# Altium schematic sheet 05 MCU_C.SchDoc
size 513 x 386 mm
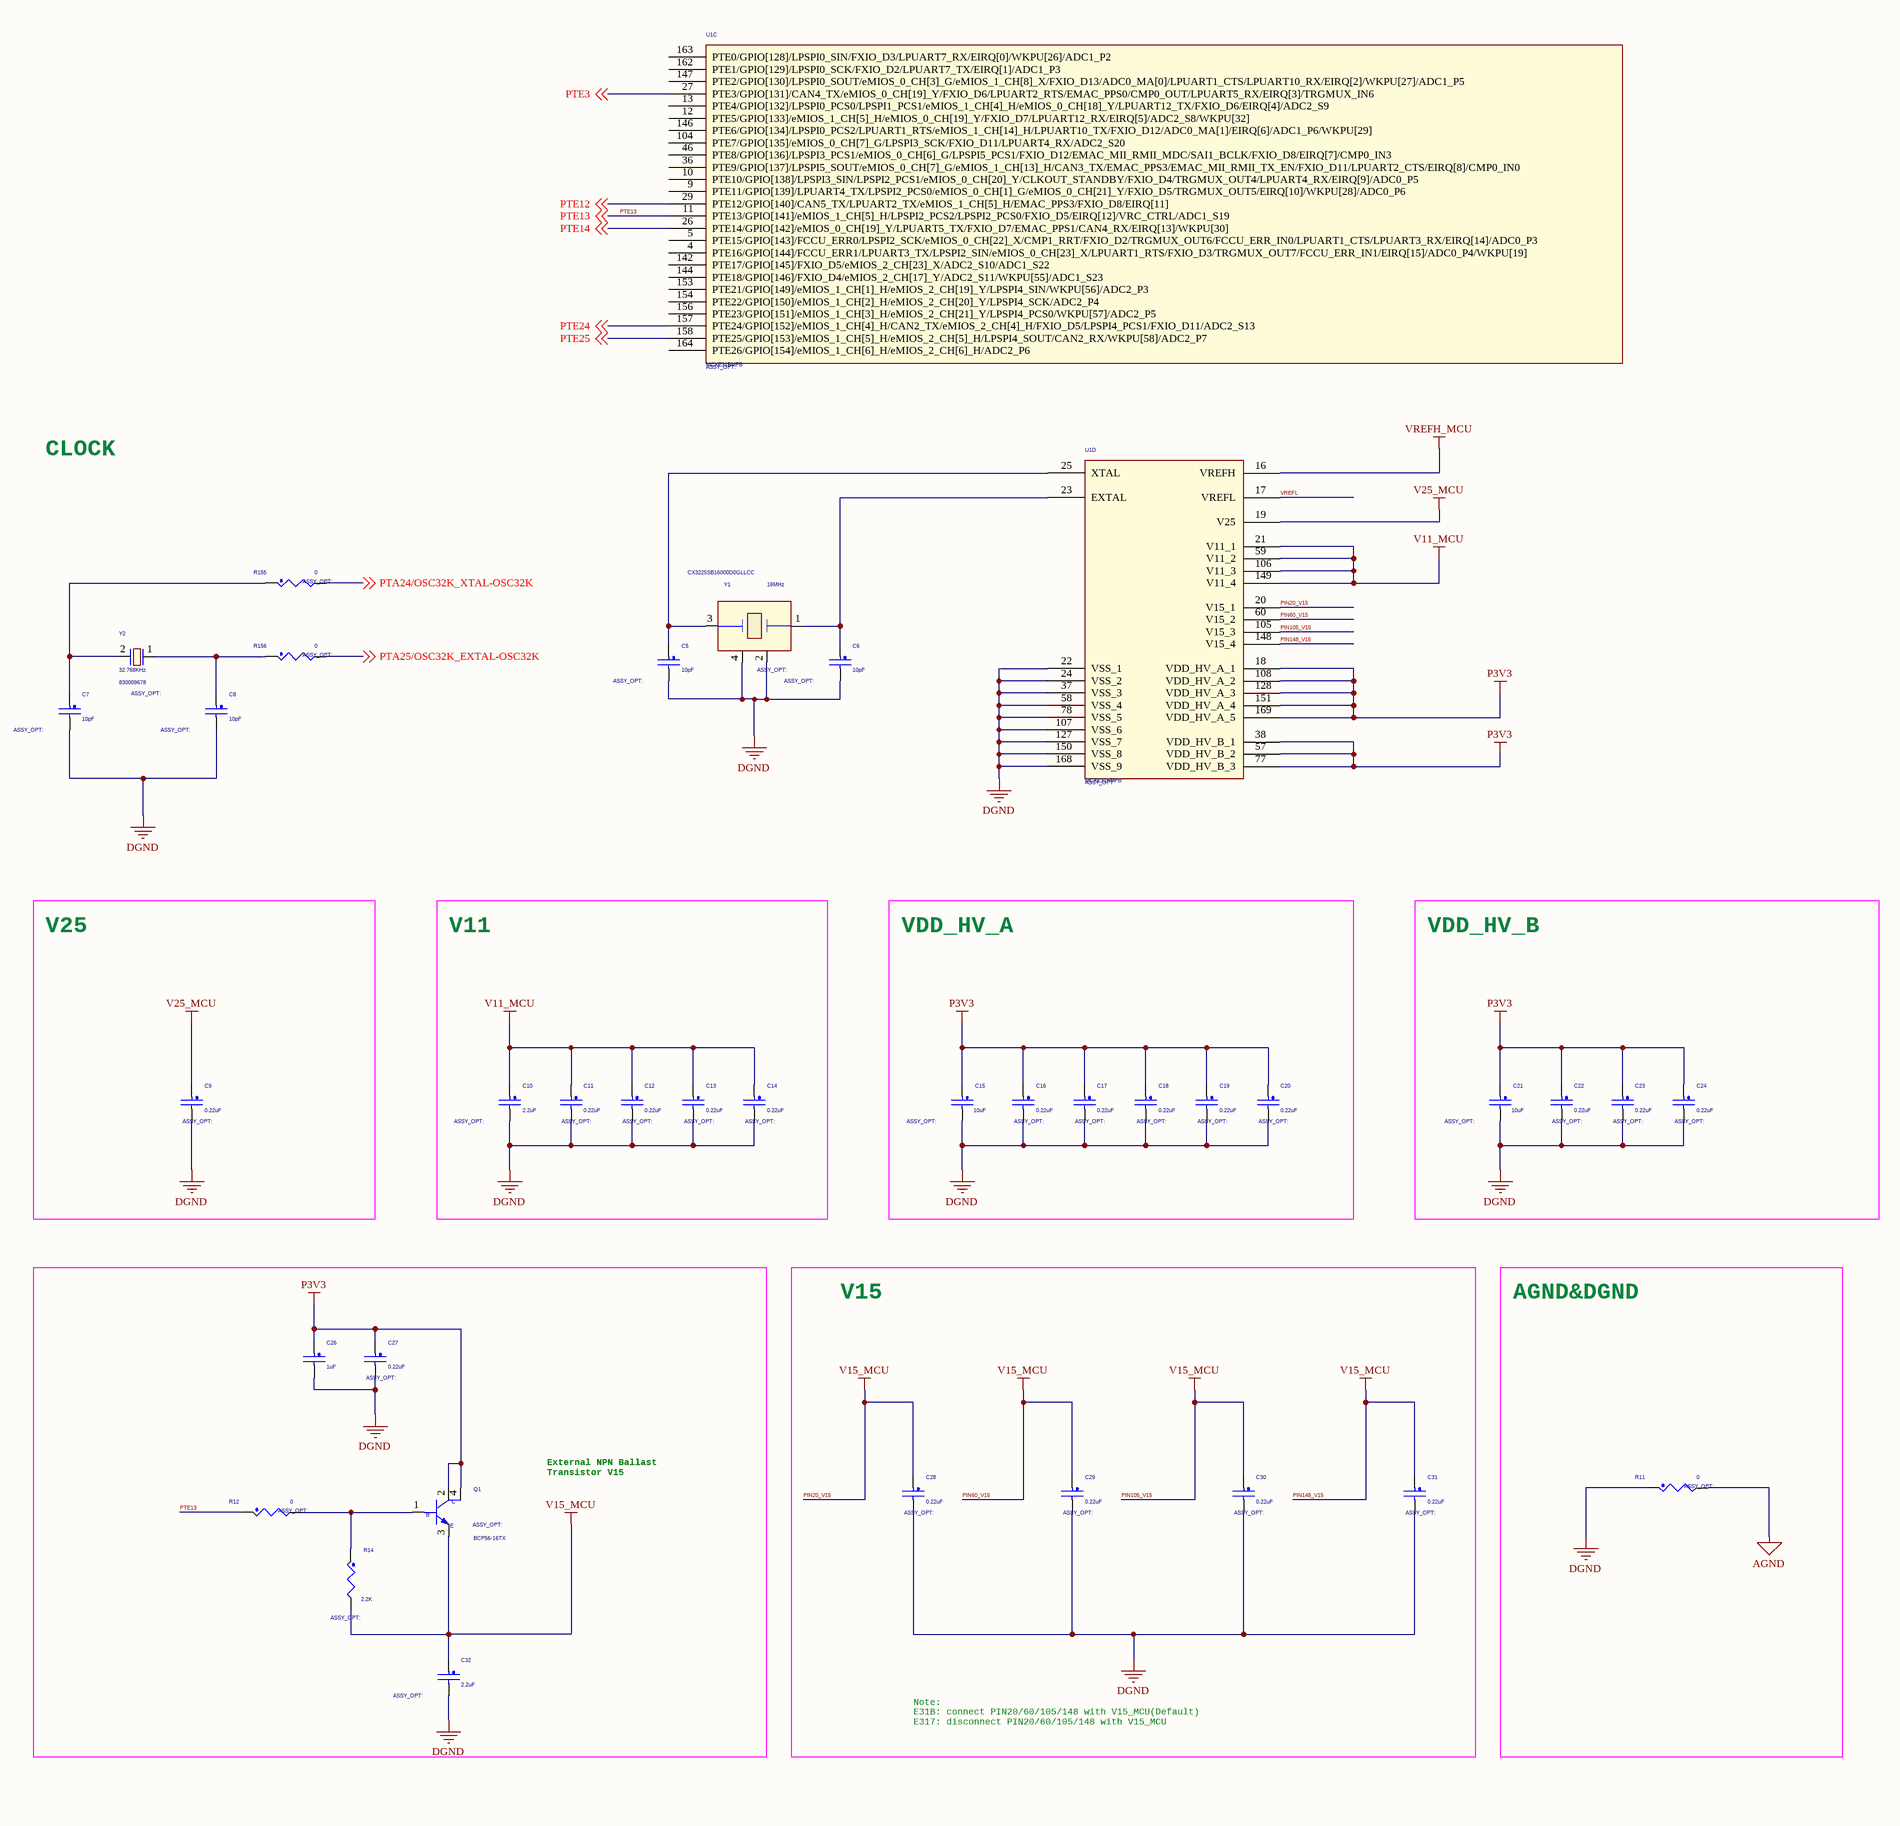
[diagram p0: 05 MCU_C.SchDoc, left]
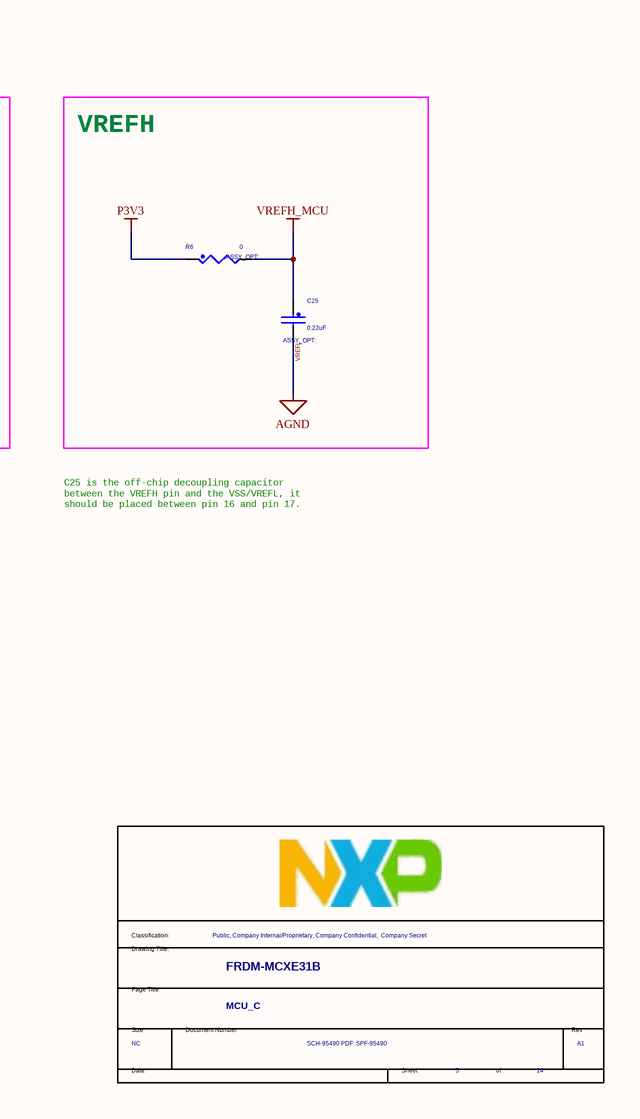
[diagram p1: 05 MCU_C.SchDoc, right]

## Parts
*  Title: FRDM-MCXE31B  RevCode: A1  PageTitle: MCU_C  Page Size: NC  Page Number: 5  Page Count: 14  Doc: SCH-95490 PDF: SPF-95490  Classification: Public, Company Internal/Proprietary, Company Confidential,  Company Secret  (hidden comment: TitleBlock_FS)  (graphical)
C5  10pF  [CC0402_25]
C6  10pF  [CC0402_25]
C7  10pF  [CC0402_25]
C8  10pF  [CC0402_25]
C9  0.22uF  [CC0402_25]
C10  2.2uF  [CC0402_25]
C11  0.22uF  [CC0402_25]
C12  0.22uF  [CC0402_25]
C13  0.22uF  [CC0402_25]
C14  0.22uF  [CC0402_25]
C15  10uF  [CC0603_OV]
C16  0.22uF  [CC0402_25]
C17  0.22uF  [CC0402_25]
C18  0.22uF  [CC0402_25]
C19  0.22uF  [CC0402_25]
C20  0.22uF  [CC0402_25]
C21  10uF  [CC0603_OV]
C22  0.22uF  [CC0402_25]
C23  0.22uF  [CC0402_25]
C24  0.22uF  [CC0402_25]
C25  0.22uF  [CC0402_25]
C26  1uF  [CC0402_25]
C27  0.22uF  [CC0402_25]
C28  0.22uF  [CC0402_25]
C29  0.22uF  [CC0402_25]
C30  0.22uF  [CC0402_25]
C31  0.22uF  [CC0402_25]
C32  2.2uF  [CC0402_25]
Q1  BCP56-16TX  [SOT223]
R6  0  [RC0402_25]
R11  0  [RC0603_OV]
R12  0  [RC0603_OV]
R14  2.2K  [RC0402_25]
R155  0  [RC0402_25]
R156  0  [RC0402_25]
U1  MCXE31BMPB  [QFP-172_L16.0-W16.0-P0.65-LS19.0-TL]  (parts C,D of 4)
Y1  16MHz  MFG_PN01: CX3225SB16000D0GLLCC  [X322516MLB4SI]
Y2  32.768KHz  MFG_PN01: 830009678  [XTAL2-3p2x1p5-SM]

## Blocks framed on the sheet
V25: C9
V11: C10-C14
VDD_HV_A: C15-C20
VDD_HV_B: C21-C24
VREFH: C25 R6
V15: C28-C31
AGND&DGND: R11

## Nets
DGND: C5.2 C6.2 C7.2 C8.2 C9.2 C10.2 C11.2 C12.2 C13.2 C14.2 C15.2 C16.2 C17.2 C18.2 C19.2 C20.2 C21.2 C22.2 C23.2 C24.2 C26.2 C27.2 C28.2 C29.2 C30.2 C31.2 C32.2 R11.1 U1.22(VSS_1) U1.24(VSS_2) U1.37(VSS_3) U1.58(VSS_4) U1.78(VSS_5) U1.107(VSS_6) U1.127(VSS_7) U1.150(VSS_8) U1.168(VSS_9) Y1.2 Y1.4
P3V3: C15.1 C16.1 C17.1 C18.1 C19.1 C20.1 C21.1 C22.1 C23.1 C24.1 C26.1 C27.1 Q1.2(COLLECTOR) Q1.4(COLLECTOR1) R6.1 U1.18(VDD_HV_A_1) U1.38(VDD_HV_B_1) U1.57(VDD_HV_B_2) U1.77(VDD_HV_B_3) U1.108(VDD_HV_A_2) U1.128(VDD_HV_A_3) U1.151(VDD_HV_A_4) U1.169(VDD_HV_A_5)
PIN105_V15: C28.1 C29.1 C30.1 C31.1 C32.1 Q1.3(EMITTER) R14.2 U1.20(V15_1) U1.60(V15_2) U1.105(V15_3) U1.148(V15_4)  [also labelled PIN148_V15, PIN20_V15, PIN60_V15, V15_MCU]
V11_MCU: C10.1 C11.1 C12.1 C13.1 C14.1 U1.21(V11_1) U1.59(V11_2) U1.106(V11_3) U1.149(V11_4)
V25_MCU: C9.1 U1.19(V25)
VREFH_MCU: C25.1 R6.2 U1.16(VREFH)
VREFL: C25.2 R11.2 U1.17(VREFL)  [also labelled AGND]
PTA24/OSC32K_XTAL-OSC32K: R155.2 ; off-sheet PTA24/OSC32K_XTAL-OSC32K
PTA25/OSC32K_EXTAL-OSC32K: R156.2 ; off-sheet PTA25/OSC32K_EXTAL-OSC32K
PTE3: U1.27(PTE3/GPIO[131]/CAN4_TX/eMIOS_0_CH[19]_Y/FXIO_D6/LPUART2_RTS/EMAC_PPS0/CMP0_OUT/LPUART5_RX/EIRQ[3]/TRGMUX_IN6) ; off-sheet PTE3
PTE12: U1.29(PTE12/GPIO[140]/CAN5_TX/LPUART2_TX/eMIOS_1_CH[5]_H/EMAC_PPS3/FXIO_D8/EIRQ[11]) ; off-sheet PTE12
PTE13: R12.1 U1.11(PTE13/GPIO[141]/eMIOS_1_CH[5]_H/LPSPI2_PCS2/LPSPI2_PCS0/FXIO_D5/EIRQ[12]/VRC_CTRL/ADC1_S19) ; off-sheet PTE13
PTE14: U1.26(PTE14/GPIO[142]/eMIOS_0_CH[19]_Y/LPUART5_TX/FXIO_D7/EMAC_PPS1/CAN4_RX/EIRQ[13]/WKPU[30]) ; off-sheet PTE14
PTE24: U1.157(PTE24/GPIO[152]/eMIOS_1_CH[4]_H/CAN2_TX/eMIOS_2_CH[4]_H/FXIO_D5/LPSPI4_PCS1/FXIO_D11/ADC2_S13) ; off-sheet PTE24
PTE25: U1.158(PTE25/GPIO[153]/eMIOS_1_CH[5]_H/eMIOS_2_CH[5]_H/LPSPI4_SOUT/CAN2_RX/WKPU[58]/ADC2_P7) ; off-sheet PTE25
NetC5_1: C5.1 U1.25(XTAL) Y1.3
NetC6_1: C6.1 U1.23(EXTAL) Y1.1
NetC7_1: C7.1 R155.1 Y2.2
NetC8_1: C8.1 R156.1 Y2.1
NetQ1_1: Q1.1(BASE) R12.2 R14.1

Not connected (* = marked no-connect by the designer): U1 4(PTE16/GPIO[144]/FCCU_ERR1/LPUART3_TX/LPSPI2_SIN/eMIOS_0_CH[23]_X/LPUART1_RTS/FXIO_D3/TRGMUX_OUT7/FCCU_ERR_IN1/EIRQ[15]/ADC0_P4/WKPU[19]) 5(PTE15/GPIO[143]/FCCU_ERR0/LPSPI2_SCK/eMIOS_0_CH[22]_X/CMP1_RRT/FXIO_D2/TRGMUX_OUT6/FCCU_ERR_IN0/LPUART1_CTS/LPUART3_RX/EIRQ[14]/ADC0_P3) 9(PTE11/GPIO[139]/LPUART4_TX/LPSPI2_PCS0/eMIOS_0_CH[1]_G/eMIOS_0_CH[21]_Y/FXIO_D5/TRGMUX_OUT5/EIRQ[10]/WKPU[28]/ADC0_P6) 10(PTE10/GPIO[138]/LPSPI3_SIN/LPSPI2_PCS1/eMIOS_0_CH[20]_Y/CLKOUT_STANDBY/FXIO_D4/TRGMUX_OUT4/LPUART4_RX/EIRQ[9]/ADC0_P5) 12(PTE5/GPIO[133]/eMIOS_1_CH[5]_H/eMIOS_0_CH[19]_Y/FXIO_D7/LPUART12_RX/EIRQ[5]/ADC2_S8/WKPU[32]) 13(PTE4/GPIO[132]/LPSPI0_PCS0/LPSPI1_PCS1/eMIOS_1_CH[4]_H/eMIOS_0_CH[18]_Y/LPUART12_TX/FXIO_D6/EIRQ[4]/ADC2_S9) 36(PTE9/GPIO[137]/LPSPI5_SOUT/eMIOS_0_CH[7]_G/eMIOS_1_CH[13]_H/CAN3_TX/EMAC_PPS3/EMAC_MII_RMII_TX_EN/FXIO_D11/LPUART2_CTS/EIRQ[8]/CMP0_IN0) 46(PTE8/GPIO[136]/LPSPI3_PCS1/eMIOS_0_CH[6]_G/LPSPI5_PCS1/FXIO_D12/EMAC_MII_RMII_MDC/SAI1_BCLK/FXIO_D8/EIRQ[7]/CMP0_IN3) 104(PTE7/GPIO[135]/eMIOS_0_CH[7]_G/LPSPI3_SCK/FXIO_D11/LPUART4_RX/ADC2_S20) 142(PTE17/GPIO[145]/FXIO_D5/eMIOS_2_CH[23]_X/ADC2_S10/ADC1_S22) 144(PTE18/GPIO[146]/FXIO_D4/eMIOS_2_CH[17]_Y/ADC2_S11/WKPU[55]/ADC1_S23) 146(PTE6/GPIO[134]/LPSPI0_PCS2/LPUART1_RTS/eMIOS_1_CH[14]_H/LPUART10_TX/FXIO_D12/ADC0_MA[1]/EIRQ[6]/ADC1_P6/WKPU[29]) 147(PTE2/GPIO[130]/LPSPI0_SOUT/eMIOS_0_CH[3]_G/eMIOS_1_CH[8]_X/FXIO_D13/ADC0_MA[0]/LPUART1_CTS/LPUART10_RX/EIRQ[2]/WKPU[27]/ADC1_P5) 153(PTE21/GPIO[149]/eMIOS_1_CH[1]_H/eMIOS_2_CH[19]_Y/LPSPI4_SIN/WKPU[56]/ADC2_P3) 154(PTE22/GPIO[150]/eMIOS_1_CH[2]_H/eMIOS_2_CH[20]_Y/LPSPI4_SCK/ADC2_P4) 156(PTE23/GPIO[151]/eMIOS_1_CH[3]_H/eMIOS_2_CH[21]_Y/LPSPI4_PCS0/WKPU[57]/ADC2_P5) 162(PTE1/GPIO[129]/LPSPI0_SCK/FXIO_D2/LPUART7_TX/EIRQ[1]/ADC1_P3) 163(PTE0/GPIO[128]/LPSPI0_SIN/FXIO_D3/LPUART7_RX/EIRQ[0]/WKPU[26]/ADC1_P2) 164(PTE26/GPIO[154]/eMIOS_1_CH[6]_H/eMIOS_2_CH[6]_H/ADC2_P6)

## Notes on the sheet
- CLOCK
- C25 is the off-chip decoupling capacitor
  between the VREFH pin and the VSS/VREFL, it
  should be placed between pin 16 and pin 17.
- External NPN Ballast
  Transistor V15
- Note:
  E31B: connect PIN20/60/105/148 with V15_MCU(Default)
  E317: disconnect PIN20/60/105/148 with V15_MCU
- (in symbol TitleBlock_FS) Classification:; Drawing Title:; Page Title:; Size; Document Number; Rev; Date:; Sheet; of
- (in symbol TRAN_NPN_SOT223) C; B; E

## Library data of the parts
* = TitleBlock_FS: OrgAddr2: Austin, TX 78735-8598; OrgAddr1: 6501 William Cannon Drive West; OrgName: NXP Semiconductors; Page Create Date: March  8, 1995
C5 = CAP_NP: CAP CER 10pF 50V 5% C0G AEC-Q200 0402; CLASS: DISCRETE; AGILE_PN: 150-79023; FPLIST: CC0402_25,CC0402_HD,0402_CC,capc0402_l; CAD_APPROVED: Yes; Temp Range: -55C to +125C; MFG_NAME01: MURATA; MFG_PN01: GCM1555C1H100JA16; Package Size: 0402 [1005 Metric]; HEIGHT: 0.55; Package Type: SMD/SMT; Tolerance: 5%; Rated Voltage: 50V; ROHS: Yes; VOLTAGE: 50V; 3D_Mechanical_Footprint_File: http://fcl.am.freescale.net/ALLEGRO/step/cc0402_25.STEP
C6-C8 = CAP_NP: CAP CER 10pF 50V 5% C0G AEC-Q200 0402; CLASS: DISCRETE; MFG_PN01: GCM1555C1H100JA16; MFG_NAME01: MURATA; Temp Range: -55C to +125C; CAD_APPROVED: Yes; FPLIST: CC0402_25,CC0402_HD,0402_CC,capc0402_l; AGILE_PN: 150-79023; 3D_Mechanical_Footprint_File: http://fcl.am.freescale.net/ALLEGRO/step/cc0402_25.STEP; VOLTAGE: 50V; ROHS: Yes; Rated Voltage: 50V; Tolerance: 5%; Package Type: SMD/SMT; HEIGHT: 0.55; Package Size: 0402 [1005 Metric]
C9 C11-C14 C16-C20 C25 C27 = CAP_NP: CAP CER 0.22UF 16V 10% X7R 0402; CLASS: DISCRETE; AGILE_PN: 150-78886; MFG_NAME01: FENGHUA; MFG_PN01: 0402B224K160NT; CAD_APPROVED: Yes; FPLIST: CC0402_25,CC0402_HD,0402_CC; Temp Range: -55C to +125C; Tolerance: 10%; ROHS: Yes; HEIGHT: 0.55; VOLTAGE: 16V; Package Size: 0402 [1005 Metric]; Package Type: SMD/SMT; Rated Voltage: 16V; 3D_Mechanical_Footprint_File: http://fcl.am.freescale.net/ALLEGRO/step/cc0402_25.STEP
C10 C32 = CAP_NP: CAP CER 2.2UF 10V 20% X5R 0402; CLASS: DISCRETE; MFG_PN01: C0402C225M8PACTU; MFG_NAME01: KEMET; Temp Range: -55C to +85C; CAD_APPROVED: Yes; FPLIST: CC0402_25,CC0402_HD,0402_CC,capc0402_l; AGILE_PN: 150-79665; 3D_Mechanical_Footprint_File: http://fcl.am.freescale.net/ALLEGRO/step/cc0402_25.STEP; ROHS: Yes; Rated Voltage: 10V; Tolerance: 20%; HEIGHT: 0.55
C15 C21 = CAP_NP: CAP CER 10uF 25V 20% X5R 0603; CLASS: DISCRETE; AGILE_PN: 150-79272; CAD_APPROVED: Yes; Temp Range: -55C to +85C; MFG_NAME01: MURATA; MFG_PN01: GRM188R61E106MA73D; FPLIST: CC0603_OV,CC0603,0603_cc_tol; Package Size: 0603; HEIGHT: 1; Tolerance: 20%; Rated Voltage: 25V; ROHS: Yes
C22-C24 C28-C31 = CAP_NP: CAP CER 0.22UF 16V 10% X7R 0402; CLASS: DISCRETE; Temp Range: -55C to +125C; FPLIST: CC0402_25,CC0402_HD,0402_CC; CAD_APPROVED: Yes; MFG_PN01: 0402B224K160NT; MFG_NAME01: FENGHUA; AGILE_PN: 150-78886; 3D_Mechanical_Footprint_File: http://fcl.am.freescale.net/ALLEGRO/step/cc0402_25.STEP; Rated Voltage: 16V; Package Type: SMD/SMT; Package Size: 0402 [1005 Metric]; VOLTAGE: 16V; HEIGHT: 0.55; ROHS: Yes; Tolerance: 10%
C26 = CAP_NP: CAP CER 1.0uF 16V 10% X6S 0402; CLASS: DISCRETE; Temp Range: -55C to +105C; FPLIST: CC0402_25,CC0402_HD,0402_CC,capc0402_l; CAD_APPROVED: Yes; MFG_PN01: GRM155C81C105KE11D; MFG_NAME01: MURATA; AGILE_PN: 150-80262; SIGNAL_MODEL: DEFAULT_CAPACITOR_1e+06pF_2_1; Temp_Range: -55癈 to +125癈; Rated Voltage: 16V; VOLTAGE: 16V; HEIGHT: 0.55; ROHS: Yes; Tolerance: 10%
Q1 = TRAN_NPN_SOT223: TRANS NPN 80V 1A AEC-Q101 SOT223; CLASS: IC; AGILE_PN: 480-79956; MFG_NAME01: NEXPERIA; Temp_Range: -55癈 ~ 150癈; CAD_APPROVED: Yes; Temp Range: -55°C ~ 150°C; MFG_PN01: BCP56-16TX; ROHS: Yes; HEIGHT: 1.8
R6 R11 R12 R155 = RES: RES MF ZERO OHM 1/10W -- 0603; CLASS: DISCRETE; Temp Range: –55 °C to +155 °C; VOLTAGE: 1/16W; FPLIST: RC0603_OV,RC0603,R603-X2,r603-x2_b,0603_CC,IND_0603HP_NSP,CC0603_OV_NSP; CAD_APPROVED: Yes; MFG_PN01: CRCW06030000Z0EAC; MFG_NAME01: VISHAY; AGILE_PN: 470-80866; ROHS: NULL; HEIGHT: 0.6
R14 = RES: RES MF 2.2K 1/16W 1% 0402; CLASS: DISCRETE; Temp Range: -55 °C to +155 °C; FPLIST: RC0402_25,RC0402_HD,0402_CC; CAD_APPROVED: yes; Temp_Range: -55C to +155C; MFG_PN01: CR0402-FX-2201GLF; MFG_NAME01: Bourns Inc.; AGILE_PN: 470-83213; HEIGHT: 0.4mm; ROHS: NULL; 3D_Mechanical_Footprint_File: http://fcl.am.freescale.net/ALLEGRO/step/rc0402_25.STEP
R156 = RES: RES MF ZERO OHM 1/10W -- 0603; CLASS: DISCRETE; AGILE_PN: 470-80866; MFG_NAME01: VISHAY; MFG_PN01: CRCW06030000Z0EAC; CAD_APPROVED: Yes; FPLIST: RC0603_OV,RC0603,R603-X2,r603-x2_b,0603_CC,IND_0603HP_NSP,CC0603_OV_NSP; VOLTAGE: 1/16W; Temp Range: –55 °C to +155 °C; HEIGHT: 0.6; ROHS: NULL
U1 = MCXE318MPB_172P: IC MCU 4M FLASH 2.97-5.5V 160MHZ HDQFP172; AGILE_PN: TMP-CIP-19819; CAD_APPROVED: Yes; PRE_APN: 344-10070; Temp Range: -40°C to +125°C; MFG_NAME01: NXP SEMICONDUCTOR; CLASS: IC; HEIGHT: 1.75mm; ROHS: NULL; MFG_PN01: MCXE31BMPB; 3D_Mechanical_Footprint_File: http://fcl.am.freescale.net/ALLEGRO/step/hdqfp172_0P65_16X16_sm.STEP
Y1 = XTAL_13: XTAL 16MHz 8pF 15PPM 3225 SMT; CLASS: IC; AGILE_PN: 230-10068; CAD_APPROVED: Yes; Temp Range: -30C to +85C; MFG_NAME01: KYOCERA; Package Size: 3.2 mm x 2.5 mm x 0.6 mm; HEIGHT: 0.6mm; Frequency Tolerance: ±15ppm; ROHS: NULL; 3D_Mechanical_Footprint_File: http://fcl.am.freescale.net/ALLEGRO/step/xtal4_cx3225ca_sm.STEP
Y2 = CRYSTAL: XTAL 32.768kHz 12.5pF 1.05pF 20ppm SMT; CLASS: IC; MFG_NAME01: Wurth Electronics Inc.; CAD_APPROVED: Yes; AGILE_PN: 230-78676; 3D_Mechanical_Footprint_File: http://fcl.am.freescale.net/ALLEGRO/step/xtal2-3p2x1p5-sm.step; ROHS: Yes; HEIGHT: 0.9